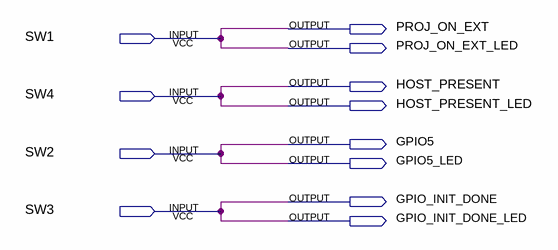
[diagram p0: schematic sheet]
// Quartus schematic gpio.bdf as structural Verilog: 0 symbols, 12 pins
module gpio (
  input  SW1,
  input  SW4,
  input  SW2,
  input  SW3,
  output PROJ_ON_EXT,
  output PROJ_ON_EXT_LED,
  output HOST_PRESENT,
  output HOST_PRESENT_LED,
  output GPIO5,
  output GPIO5_LED,
  output GPIO_INIT_DONE,
  output GPIO_INIT_DONE_LED
);


  assign GPIO5 = SW2;
  assign GPIO5_LED = SW2;
  assign GPIO_INIT_DONE = SW3;
  assign GPIO_INIT_DONE_LED = SW3;
  assign HOST_PRESENT = SW4;
  assign HOST_PRESENT_LED = SW4;
  assign PROJ_ON_EXT = SW1;
  assign PROJ_ON_EXT_LED = SW1;
endmodule
